# Altium schematic sheet Э3_1.SchDoc
size 420 x 297 mm; SheetNumber: 1; SheetTotal: 7; Scale: 1:1; DocumentType: Схема электрическая принципиальная
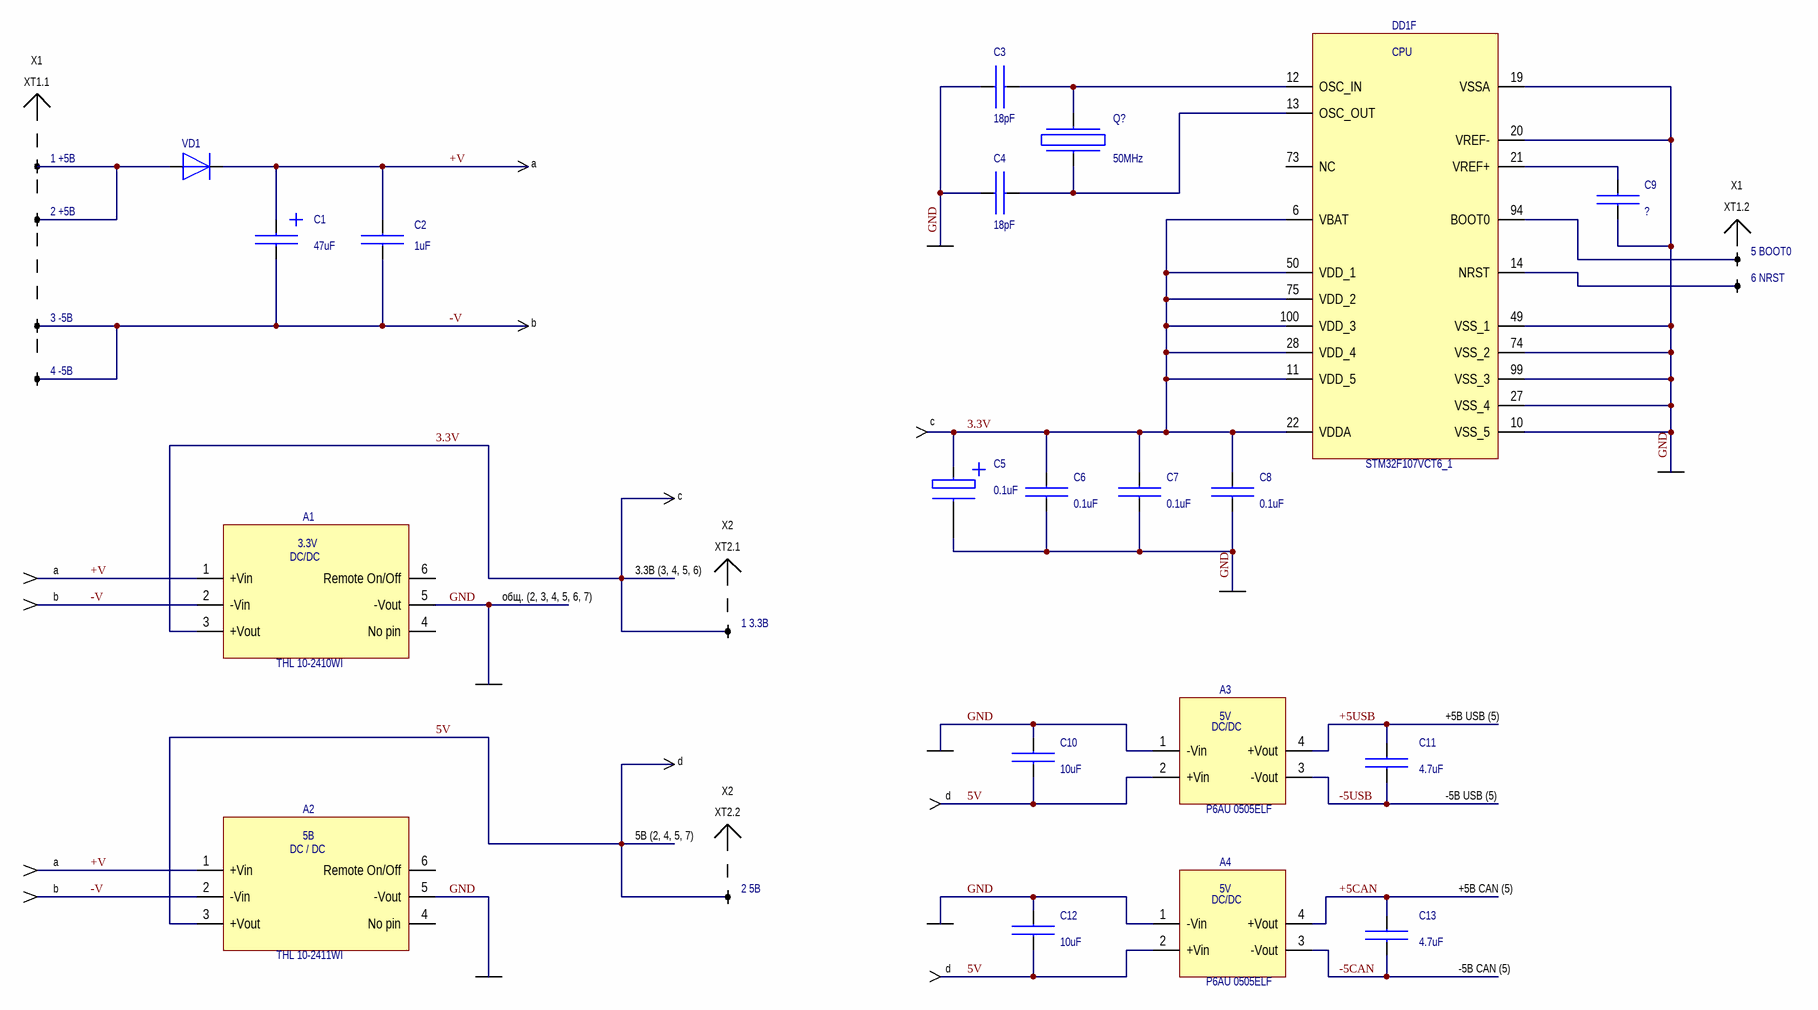
[diagram p0: Э3_1.SchDoc]

## Parts
A1  THL 10-2410WI  [compact1x1case]
A2  THL 10-2411WI  [compact1x1case]
A3  P6AU 0505ELF  [SIP4]
A4  P6AU 0505ELF  [SIP4]
C1  47uF  [CAPT]
C2  1uF  [CAP0805]
C3  18pF  [CAP0805]
C4  18pF  [CAP0805]
C5  0.1uF  [CAPT]
C6  0.1uF  [CAP0805]
C7  0.1uF  [CAP0805]
C8  0.1uF  [CAP0805]
C9  ?  [CAP0805]
C10  10uF  [CAP0805]
C11  4.7uF  [CAP0805]
C12  10uF  [CAP0805]
C13  4.7uF  [CAP0805]
DD1  STM32F107VCT6_1  [LQFP100_N]  (part F of 6)
Q?  50МHz  [РК386]
VD1  BAV102  [BAV102]  (value not drawn)
X1  1 +5В  [PLD10]  (parts A,B,C,D,E,F of 10)
X4  1 3.3В  [PLD10]  (parts A,B of 10)

## Nets
3.3V: A1.3(+Vout) C5.1 C6.2 C7.2 C8.2 DD1.6(VBAT) DD1.11(VDD_5) DD1.22(VDDA) DD1.28(VDD_4) DD1.50(VDD_1) DD1.75(VDD_2) DD1.100(VDD_3) X4.1
5V: A2.3(+Vout) A3.2(+Vin) A4.2(+Vin) C10.1 C12.1 X4.2
+5CAN: A4.4(+Vout) C13.2  [also labelled +5В CAN]
+5USB: A3.4(+Vout) C11.2
+V: A1.1(+Vin) A2.1(+Vin) C1.1 C2.2 VD1.2
-5CAN: A4.3(-Vout) C13.1
-5USB: A3.3(-Vout) C11.1
-V: A1.2(-Vin) A2.2(-Vin) C1.2 C2.1 X1.3 X1.4
GND: A1.5(-Vout) A2.5(-Vout) A3.1(-Vin) A4.1(-Vin) C3.2 C4.1 C6.1 C7.1 C8.1 C9.1 C10.2 C12.2 DD1.10(VSS_5) DD1.19(VSSA) DD1.20(VREF-) DD1.27(VSS_4) DD1.49(VSS_1) DD1.74(VSS_2) DD1.99(VSS_3)
NetC3_1: C3.1 DD1.12(OSC_IN) Q?.2
NetC4_2: C4.2 DD1.13(OSC_OUT) Q?.1
NetC9_2: C9.2 DD1.21(VREF+)
NetDD1_14: DD1.14(NRST) X1.6
NetDD1_94: DD1.94(BOOT0) X1.5
NetVD1_1: VD1.1 X1.1 X1.2

Not connected (* = marked no-connect by the designer): A1 4(No_pin) 6(Remote_On/Off); A2 4(No_pin) 6(Remote_On/Off); C5 2; DD1 73(NC)

## Notes on the sheet
- X1
- XT1.1
- a
- (near X1) XT1.2
- b
- (near C5) c
- c
- XT2.1
- X2
- общ. (2, 3, 4, 5, 6, 7)
- (near X4) 3.3В (3, 4, 5, 6)
- +5В USB (5)
- d
- XT2.2
- -5В USB (5)
- (near X4) 5В (2, 4, 5, 7)
- +5В CAN (5)
- -5В CAN (5)
- Перв. примен.
- Справ. №
- Подп. и дата
- Инв. № дубл.
- Взам. инв. №
- Разраб.
- Изм.
- Лист
- № докум.
- Подп.
- Дата
- Лит.
- Масса
- Масштаб
- Пров.
- Т.контр.
- Листов
- Инв. № подл.
- Утв.
- Н.контр.
- 2.106-A3
- Копировал
- Формат А3
- (in symbol P6AU 0505ELF) 5V; DC/DC
- (in symbol STM32F107VCT6_1, part F) CPU
- (in symbol THL 10-2410WI) 3.3V; DC/DC
- (in symbol THL 10-2411WI) 5В; DC / DC

## Library data of the parts
C1 = CT
C2-C4 C6-C10 C12 C13 = C
C5 = CL
C11 = C_2
Q? = 9B50.000MEEJ-B
X1 X4 = PLD10